# Altium schematic sheet LoRaUNO868 V2.SchDoc: The Things Uno
size A3; DocumentNumber: 1; SheetNumber: 1; SheetTotal: 1
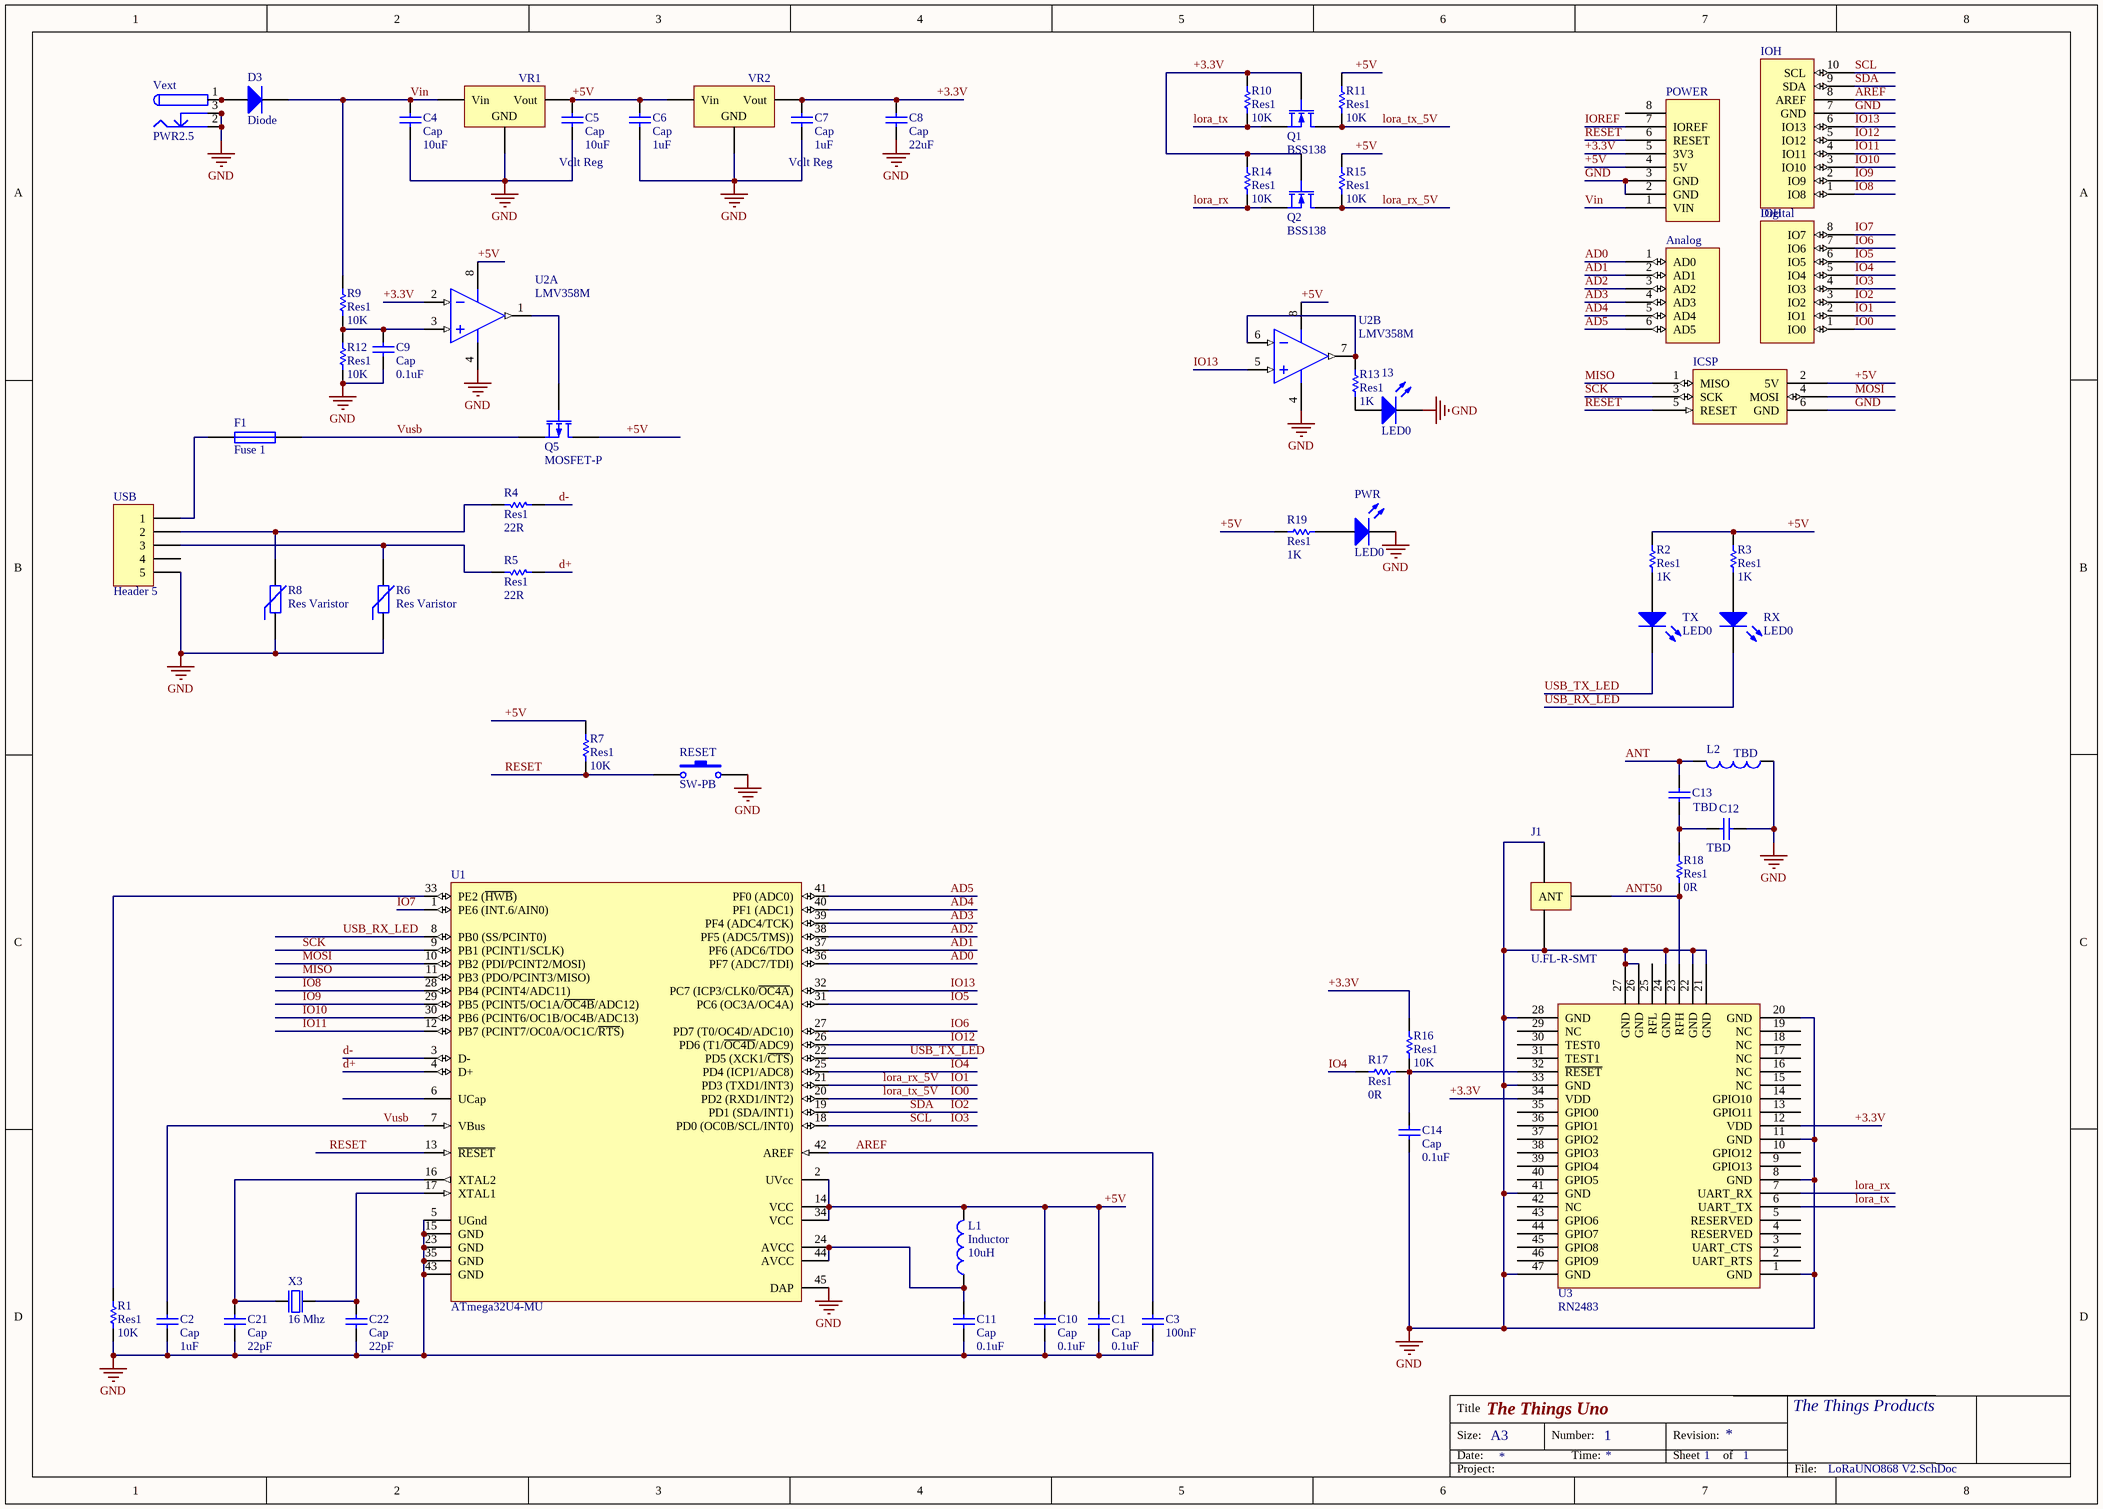
[diagram p0: LoRaUNO868 V2.SchDoc]

## Parts
13  LED0  [C0805]
Analog  AD  [Header 6x1 8.5mm]  (value not drawn)
C1  Cap  value 0.1uF  [C0805]
C2  Cap  value 1uF  [C0805]
C3  100nF  [6-0805_L]
C4  Cap  value 10uF  [C0805]
C5  Cap  value 10uF  [C0805]
C6  Cap  value 1uF  [C0805]
C7  Cap  value 1uF  [C0805]
C8  Cap  value 22uF  [C1206]
C9  Cap  value 0.1uF  [C0805]
C10  Cap  value 0.1uF  [C0805]
C11  Cap  value 0.1uF  [C0805]
C12  TBD  [0402C-TBD]
C13  TBD  [0402C-TBD]
C14  Cap  value 0.1uF  [C0805]
C21  Cap  value 22pF  [C0805]
C22  Cap  value 22pF  [C0805]
D3  Diode  [3216[1206]]
Digital  IOL  [Header 8x1 8.5mm]  (value not drawn)
F1  Fuse 1  [1812]
ICSP  ICSP  [ICSP]  (value not drawn)
IOH  IOH  [Header 10x1 8.5mm]
J1  U.FL-R-SMT  [U.FL-R-SMT]
L1  Inductor  value 10uH  [J1-0603]
L2  TBD  [0402C-TBD]
POWER  POWER_UNO  [Header 8x1 8.5mm]  (value not drawn)
PWR  LED0  [C0805]
Q1  BSS138  [SOT23]
Q2  BSS138  [SOT23]
Q5  MOSFET-P  [SOT23_N]
R1  Res1  value 10K  [6-0805_L]
R2  Res1  value 1K  [6-0805_L]
R3  Res1  value 1K  [6-0805_L]
R4  Res1  value 22R  [6-0805_L]
R5  Res1  value 22R  [6-0805_L]
R6  Res Varistor  [6-0805_L]
R7  Res1  value 10K  [6-0805_L]
R8  Res Varistor  [6-0805_L]
R9  Res1  value 10K  [6-0805_L]
R10  Res1  value 10K  [6-0805_L]
R11  Res1  value 10K  [6-0805_L]
R12  Res1  value 10K  [6-0805_L]
R13  Res1  value 1K  [6-0805_L]
R14  Res1  value 10K  [6-0805_L]
R15  Res1  value 10K  [6-0805_L]
R16  Res1  value 10K  [6-0805_L]
R17  Res1  value 0R  [J1-0603]
R18  Res1  value 0R  [J1-0603]
R19  Res1  value 1K  [6-0805_L]
RESET  SW-PB  [BUTTON]
RX  LED0  [C0805]
TX  LED0  [C0805]
U1  ATmega32U4-MU  [44PW_M]
U2  LMV358M  [M08A_N]  (parts A,B of 2)
U3  RN2483  [RN2483 - duplicate]
USB  Header 5  [10118193-0001LF]
Vext  PWR2.5  [DC - JACK]
VR1  Volt Reg  [SOT223_N]
VR2  Volt Reg  [SOT23_L]
X3  16 Mhz  [Crystal - ABM3B]

## Nets
GND: 13.2(K) C1.2 C2.2 C3.2 C4.1 C5.1 C6.1 C7.1 C8.1 C9.1 C10.2 C11.2 C12.1 C14.2 C21.1 C22.1 ICSP.6(GND) IOH.7(GND) J1.2(GND) L2.1 POWER.2(GND) POWER.3(GND) PWR.2(K) R1.1 R6.1 R8.1 R12.2 RESET.2 U1.5(UGnd) U1.15(GND) U1.23(GND) U1.35(GND) U1.43(GND) U1.45(DAP) U2.4(V-) U3.1(GND) U3.8(GND) U3.11(GND) U3.20(GND) U3.21(GND) U3.22(GND) U3.24(GND) U3.26(GND) U3.27(GND) U3.28(GND) U3.33(GND) U3.41(GND) U3.47(GND) USB.5 Vext.2 Vext.2A Vext.2B Vext.3 Vext.3A Vext.3B VR1.2(GND) VR2.2(GND) X3.2(GND) X3.4(GND)
+3.3V: C7.2 C8.2 POWER.5(3V3) Q1.3(G) Q2.3(G) R10.2 R14.2 R16.1 U2.2(INA-) U3.12(VDD) U3.34(VDD) VR2.3(Vout)
+5V: C1.1 C5.2 C6.2 C10.1 ICSP.2(5V) L1.1 POWER.4(5V) Q5.1(D) R2.2 R3.2 R7.2 R11.2 R15.2 R19.2 U1.2(UVcc) U1.14(VCC) U1.34(VCC) U2.8(V+) VR1.3(Vout) VR2.1(Vin)
AD0: Analog.1(AD0) U1.36(PF7_(ADC7/TDI))
AD1: Analog.2(AD1) U1.37(PF6_(ADC6/TDO)
AD2: Analog.3(AD2) U1.38(PF5_(ADC5/TMS)))
AD3: Analog.4(AD3) U1.39(PF4_(ADC4/TCK))
AD4: Analog.5(AD4) U1.40(PF1_(ADC1))
AD5: Analog.6(AD5) U1.41(PF0_(ADC0))
ANT: C13.2 L2.2
ANT50: J1.1(ANT) R18.1 U3.23(RFH)
AREF: C3.1 IOH.8(AREF) U1.42(AREF)
d+: R5.1 U1.4(D+)
d-: R4.1 U1.3(D-)
IO0: Digital.1(IO0) Q1.1(D) R11.1 U1.20(PD2_(RXD1/INT2))  [also labelled lora_tx_5V]
IO1: Digital.2(IO1) Q2.1(D) R15.1 U1.21(PD3_(TXD1/INT3))  [also labelled lora_rx_5V]
IO2: Digital.3(IO2) IOH.9(SDA) U1.19(PD1_(SDA/INT1))  [also labelled SDA]
IO3: Digital.4(IO3) IOH.10(SCL) U1.18(PD0_(OC0B/SCL/INT0))  [also labelled SCL]
IO4: Digital.5(IO4) R17.1 U1.25(PD4_(ICP1/ADC8))
IO5: Digital.6(IO5) U1.31(PC6_(OC3A/OC4A))
IO6: Digital.7(IO6) U1.27(PD7_(T0/OC4D/ADC10))
IO7: Digital.8(IO7) U1.1(PE6_(INT.6/AIN0))
IO8: IOH.1(IO8) U1.28(PB4_(PCINT4/ADC11))
IO9: IOH.2(IO9) U1.29(PB5_(PCINT5/OC1A/~{OC4B}/ADC12))
IO10: IOH.3(IO10) U1.30(PB6_(PCINT6/OC1B/OC4B/ADC13))
IO11: IOH.4(IO11) U1.12(PB7_(PCINT7/OC0A/OC1C/~{RTS}))
IO12: IOH.5(IO12) U1.26(PD6_(T1/~{OC4D}/ADC9))
IO13: IOH.6(IO13) U1.32(PC7_(ICP3/CLK0/~{OC4A})) U2.5(INB+)
IOREF: POWER.7(IOREF)
lora_rx: Q2.2(S) R14.1 U3.7(UART_RX)
lora_tx: Q1.2(S) R10.1 U3.6(UART_TX)
MISO: ICSP.1(MISO) U1.11(PB3_(PDO/PCINT3/MISO))
MOSI: ICSP.4(MOSI) U1.10(PB2_(PDI/PCINT2/MOSI))
RESET: ICSP.5(RESET) POWER.6(RESET) R7.1 RESET.1 U1.13(~{RESET})
SCK: ICSP.3(SCK) U1.9(PB1_(PCINT1/SCLK))
USB_RX_LED: RX.2(K) U1.8(PB0_(SS/PCINT0))
USB_TX_LED: TX.2(K) U1.22(PD5_(XCK1/~{CTS}))
Vin: C4.2 D3.2(K) POWER.1(VIN) R9.2 VR1.1(Vin)
Vusb: C2.1 F1.2 Q5.3(S) U1.7(VBus)
Net13_1: 13.1(A) R13.1
NetC9_2: C9.2 R9.1 R12.1 U2.3(INA+)
NetC11_1: C11.1 L1.2 U1.24(AVCC) U1.44(AVCC)
NetC12_2: C12.2 C13.1 R18.2
NetC14_1: C14.1 R16.2 R17.2 U3.32(~{RESET})
NetC21_2: C21.2 U1.16(XTAL2) X3.1(inp)
NetC22_2: C22.2 U1.17(XTAL1) X3.3(out)
NetD3_1: D3.1(A) Vext.1 Vext.1A Vext.1B
NetF1_1: F1.1 USB.1
NetPWR_1: PWR.1(A) R19.1
NetQ5_2: Q5.2(G) U2.1(OUTA)
NetR1_2: R1.2 U1.33(PE2_(~{HWB}))
NetR2_1: R2.1 TX.1(A)
NetR3_1: R3.1 RX.1(A)
NetR4_2: R4.2 R8.2 USB.2
NetR5_2: R5.2 R6.2 USB.3
NetR13_2: R13.2 U2.6(INB-) U2.7(OUTB)

Not connected (* = marked no-connect by the designer): J1 3(GND); POWER 8; U1 6(UCap); U3 2(UART_RTS) 3(UART_CTS) 4(RESERVED) 5(RESERVED) 9(GPIO13) 10(GPIO12) 13(GPIO11) 14(GPIO10) 15(NC) 16(NC) 17(NC) 18(NC) 19(NC) 25(RFL) 29(NC) 30(TEST0) 31(TEST1) 35(GPIO0) 36(GPIO1) 37(GPIO2) 38(GPIO3) 39(GPIO4) 40(GPIO5) 42(NC) 43(GPIO6) 44(GPIO7) 45(GPIO8) 46(GPIO9); USB 4

## Notes on the sheet
- Title
- Size:
- Date:
- A3
- Number:
- Time:
- Revision:
- Sheet
- of
- The Things Products
- Project:
- File:

## Library data of the parts
13 PWR RX TX = LED0: Typical INFRARED GaAs LED; Published: 8-Jun-2000; LatestRevisionDate: 08-Jul-2005; LatestRevisionNote: Mech Layer 1 removed.; PackageReference: LED-0; Publisher: Altium Limited; PackageDescription: LED; 2 Leads
C1 C2 C4-C11 C14 C21 C22 = Cap: Capacitor; Published: 8-Jun-2000; LatestRevisionDate: 17-Jul-2002; LatestRevisionNote: Re-released for DXP Platform.; PackageReference: RAD-0.3; Publisher: Altium Limited; PackageDescription: Radial Cap, Thru-Hole; 2 Leads; 0.3 in Pin Spacing
C3 C12 C13 = Cap: Capacitor, X7R
  C12 C13: Supplier 1: Farnell; Supplier Part Number 1: 1835905
D3 = Diode: Default Diode; Published: 8-Jun-2000; LatestRevisionDate: 17-Jul-2002; LatestRevisionNote: Re-released for DXP Platform.; PackageVersion: Sep-1996; PackageReference: SMC; Publisher: Altium Limited; PackageDescription: DO-214-AB/SMC; 2 C-Bend Leads; Body 7.9 x 5.9 mm, inc. leads (LxW); Code_JEDEC: DO-214-AB
F1 = Fuse 1: Fuse; Published: 8-Jun-2000; LatestRevisionDate: 17-Jul-2002; LatestRevisionNote: Re-released for DXP Platform.; PackageReference: PIN-W2/E2.8; Publisher: Altium Limited; PackageDescription: Thru-Hole; 2 Leads
L1 = Inductor: Code_IEC: 1005; Published: 8-Jun-2000; LatestRevisionDate: 29-May-2009; LatestRevisionNote: IPC-7351 Footprint Added.; PackageReference: 0402-A; Publisher: Altium Limited; PackageDescription: Chip Inductor; Code_JEITA: 0402
L2 = Inductor
Q1 Q2 = BSS138: N-Channel Enhancement Mode Vertical DMOS FET; Published: 17-Dec-2003; DatasheetVersion: Mar-96; PackageVersion: 1996; PackageReference: SOT23; Publisher: Altium Limited; PackageDescription: SOT-23; 3 Leads; Body 3.1 x 2.5 mm, inc. leads (LxW max), Alternate Lead Configuration; ComponentLink1Description: Manufacturer Link; ComponentLink1URL: http://www.zetex.com/; ComponentLink2Description: Datasheet; ComponentLink2URL: www.zetex.com/3.0/pdf/BSS138.pdf
Q5 = MOSFET-P: P-Channel MOSFET; pin to pad: 2>3 3>2; Published: 8-Jun-2000; LatestRevisionDate: 17-Jul-2002; LatestRevisionNote: Re-released for DXP Platform.; PackageVersion: 1995/1996; PackageReference: E3; Publisher: Altium Limited; PackageDescription: TO, Flat Index; 3 In-Line, Axial Leads; Body Dia. 4.6mm; Lead Dia. 0.5 mm (max)
R1-R5 R7 R9-R19 = Res1: Resistor; Published: 8-Jun-2000; LatestRevisionDate: 17-Jul-2002; LatestRevisionNote: Re-released for DXP Platform.; PackageReference: AXIAL-0.3; Publisher: Altium Limited; PackageDescription: Axial Device, Thru-Hole; 2 Leads; 0.3 in Pin Spacing
R6 R8 = Res Varistor: Varistor (Voltage-Sensitive Resistor); Published: 24-Mar-1999; LatestRevisionDate: 29-May-2009; LatestRevisionNote: IPC-7351 Footprint Added.; PackageVersion: Mar-2003; PackageReference: 6-0805; Publisher: Altium Limited; PackageDescription: Chip Resistor 0805 Case Size; Code_IPC: RESC2012
RESET = SW-PB: Switch; Published: 24-Mar-1999; LatestRevisionDate: 17-Jul-2002; LatestRevisionNote: Re-released for DXP Platform.; PackageReference: SPST-2; Publisher: Altium Limited; PackageDescription: Switch; 2 Leads
U1 = ATmega32U4-MU: 8-bit AVR Microcontroller, 2.7-5.5V, 32KB Flash, 2.5KB EEPROM, 1KB SRAM, USB Controller, 44-pin QFN, Industrial Grade (-40°C to 85°C); Published: 1-Apr-2010; DatasheetVersion: revD, Jan-2009; PackageVersion: revF, Jul-2007; PackageReference: 44PW; Publisher: Altium Limited; PackageDescription: 44-Pin Quad Flat No-Lead Package, 7 x 7 mm Body, 0.5 mm Pitch (QFN); Supplier 1: Digi-Key; Supplier Part Number 1: ATMEGA32U4-MU-ND; Supplier 2: Mouser; Supplier Part Number 2: 556-ATMEGA32U4-MU; Code_JEDEC: MO-220-VKKD-1; ComponentLink1Description: Manufacturer Link; ComponentLink1URL: http://www.atmel.com/products/avr/default.asp?; ComponentLink2Description: ATmega16U4/32U4 Datasheet; ComponentLink2URL: http://www.atmel.com/dyn/resources/prod_documents/doc7766.pdf; ComponentLink3Description: ATmega16U4 ATmega32U4 Summary; ComponentLink3URL: http://www.atmel.com/dyn/resources/prod_documents/7766S.pdf; ComponentLink4Description: Atmel.com Home; ComponentLink4URL: http://www.atmel.com
U2 = LMV358M: General Purpose, Low Voltage, Rail-to-Rail Output Operational Amplifiers, 8-pin Narrow SOIC; Manufacturer: National Semiconductor; PackageTopMarking: NSZXTT*LMV*358M; PowerWise: N; Published: 4-Dec-2008; LatestRevisionDate: 13-Jan-2009; LatestRevisionNote: Sim Model Added.; DatasheetVersion: Sep-2009; PackageVersion: revM, May-2009; PackageReference: M08A; Publisher: Altium Limited; PackageDescription: SOIC Narrow, 4.9 x 3.9 x 1.45mm, 8 Lead, 1.27mm Pitch; Supplier 1: Farnell; Supplier Part Number 1: 9306730; PartNumber: LMV358M; RoHS: N; PinCount: 8; CompType: Amplifiers; Code_JEDEC: MS-012-AA; Code_IPC: SOIC127P600-8; ComponentLink1Description: LMV358 Datasheet; ComponentLink1URL: http://www.national.com/ds/LM/LMV358.pdf; ComponentLink2Description: LMV358 Web Page; ComponentLink2URL: http://www.national.com/pf/LM/LMV358.html; ComponentLink3Description: M08A Package Page; ComponentLink3URL: http://www.national.com/packaging/folders/m08a.html
USB = Header 5: Header, 5-Pin; LatestRevisionDate: 17-Jul-2002; LatestRevisionNote: Re-released for DXP Platform.; Publisher: Altium Limited
Vext = PWR2.5: Low Voltage Power Supply Connector; Published: 17-Dec-2003; DatasheetDocument: 09-May-2002; Publisher: Altium Limited; ComponentLink1Description: Manufacturer Link; ComponentLink1URL: http://domino.kycon.com/internet/Products.html
VR1 = Volt Reg: Voltage Regulator; pin to pad: 1>3 2>1 3>4; Published: 24-Mar-1999; LatestRevisionDate: 29-May-2009; LatestRevisionNote: IPC-7351 Footprint Added.; PackageReference: D2PAK; Publisher: Altium Limited; PackageDescription: 3-Pin Transistor Outline Package 2.54 mm Pitch, 15.1 mm Lead Span
VR2 = Volt Reg: Voltage Regulator; pin to pad: 2>3 3>2; Published: 24-Mar-1999; LatestRevisionDate: 29-May-2009; LatestRevisionNote: IPC-7351 Footprint Added.; PackageReference: D2PAK; Publisher: Altium Limited; PackageDescription: 3-Pin Transistor Outline Package 2.54 mm Pitch, 15.1 mm Lead Span
X3 = NX2520SA-16MHZ-STD-CSW-5: XTAL SMD 2520, 16MHz, 8pF, ±15ppm; Manufacturer: NDK; Value: 8MHz; Note: XTAL SMD 16.000MHz; Artikkelnr Noca: 22019192; Artikkelnr Simpro: N.A.; Part Number: NX2520SA-16MHZ-STD-CSW-5; Manufacturer Part Number: NX2520SA-16MHZ-STD-CSW-5; Datasheet: http://www.ndk.com/images/products/catalog/c_NX2520SA-STD-CSW-5_e.pdf; LatestRevisionDate: 2012-06-15; Pin Count: 4; Publisher: Nordic Semiconductor; Published: 2012-06-15; Supplier: Digi-Key; Supplier part number: 644-1169-1-ND; 2nd source Supplier: *; 2nd source part number: *; Footprint Doc: BT-XTAL_2520